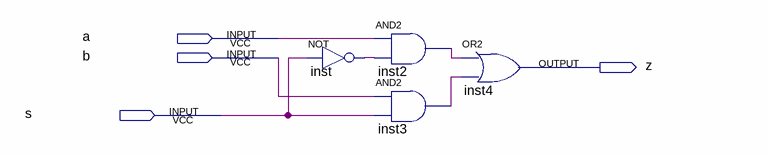
[diagram p0: schematic sheet]
// Quartus schematic Multiplexer.bdf as structural Verilog: 4 symbols, 4 pins
module Multiplexer (
  input  a,
  input  b,
  input  s,
  output z
);

  wire inst2_out, inst3_out, inst_out;

  not inst (inst_out, s);
  and inst2 (inst2_out, a, inst_out);
  and inst3 (inst3_out, b, s);
  or inst4 (z, inst2_out, inst3_out);
endmodule
